# EAGLE schematic schem_intg (EAGLE 6.5.0)
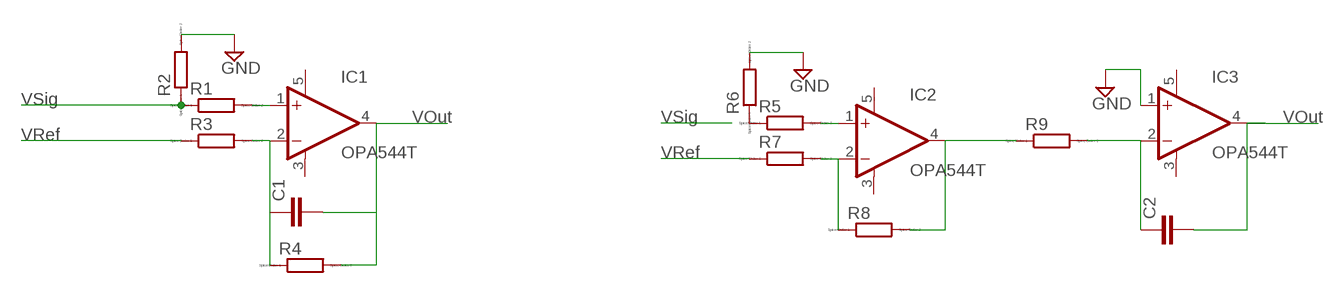
[diagram p0: schematic, sheet 1]

## Parts
C1  C2,5-3  [C2.5-3]
C2  C2,5-3  [C2.5-3]
IC1  OPA544T  [TO220-G5]
IC2  OPA544T  [TO220-G5]
IC3  OPA544T  [TO220-G5]
R1  R0204/7  [0204/7]
R2  R0204/7  [0204/7]
R3  R0204/7  [0204/7]
R4  R0204/7  [0204/7]
R5  R0204/7  [0204/7]
R6  R0204/7  [0204/7]
R7  R0204/7  [0204/7]
R8  R0204/7  [0204/7]
R9  R0204/7  [0204/7]

## Nets
GND: IC3.1(+IN) R2.2 R6.2
N$1: IC1.1(+IN) R1.2
N$2: IC1.2(-IN) R3.2 R4.1
N$3: R1.1 R2.1
N$4: C1.2 IC1.4(OUT) R4.2
N$5: R3.1
N$6: R5.1 R6.1
N$7: IC2.1(+IN) R5.2
N$8: IC2.2(-IN) R7.2 R8.1
N$9: IC2.4(OUT) R8.2 R9.1
N$10: C2.1 IC3.2(-IN) R9.2
N$11: C2.2 IC3.4(OUT)
N$14: R7.1
Unconnected: C1.1

## Notes on the sheet
- VSig
- VOut | VSig | VOut
- VRef
- VRef

## Power pins joined to a net without a drawn wire
V+: IC1.5(V+) IC2.5(V+) IC3.5(V+)
V-: IC1.3(V-) IC2.3(V-) IC3.3(V-)

## Library data of the parts
C1 C2 = capacitor-wima:C: CAPACITOR naming: grid - package width
IC1-IC3 = burr-brown:OPA544: Operational Amplifier High-Voltage, High-Current; MF: TEXAS INSTRUMENTS; MPN: OPA544T; OC_FARNELL: 1097575; OC_NEWARK: 36K2005
R1-R9 = eagle-ltspice:R: RESISTOR, European symbol; SPICEMODEL: NONE; SPICEPREFIX: R